# EAGLE schematic FubarinoMini_v17 (EAGLE 9.0.1)
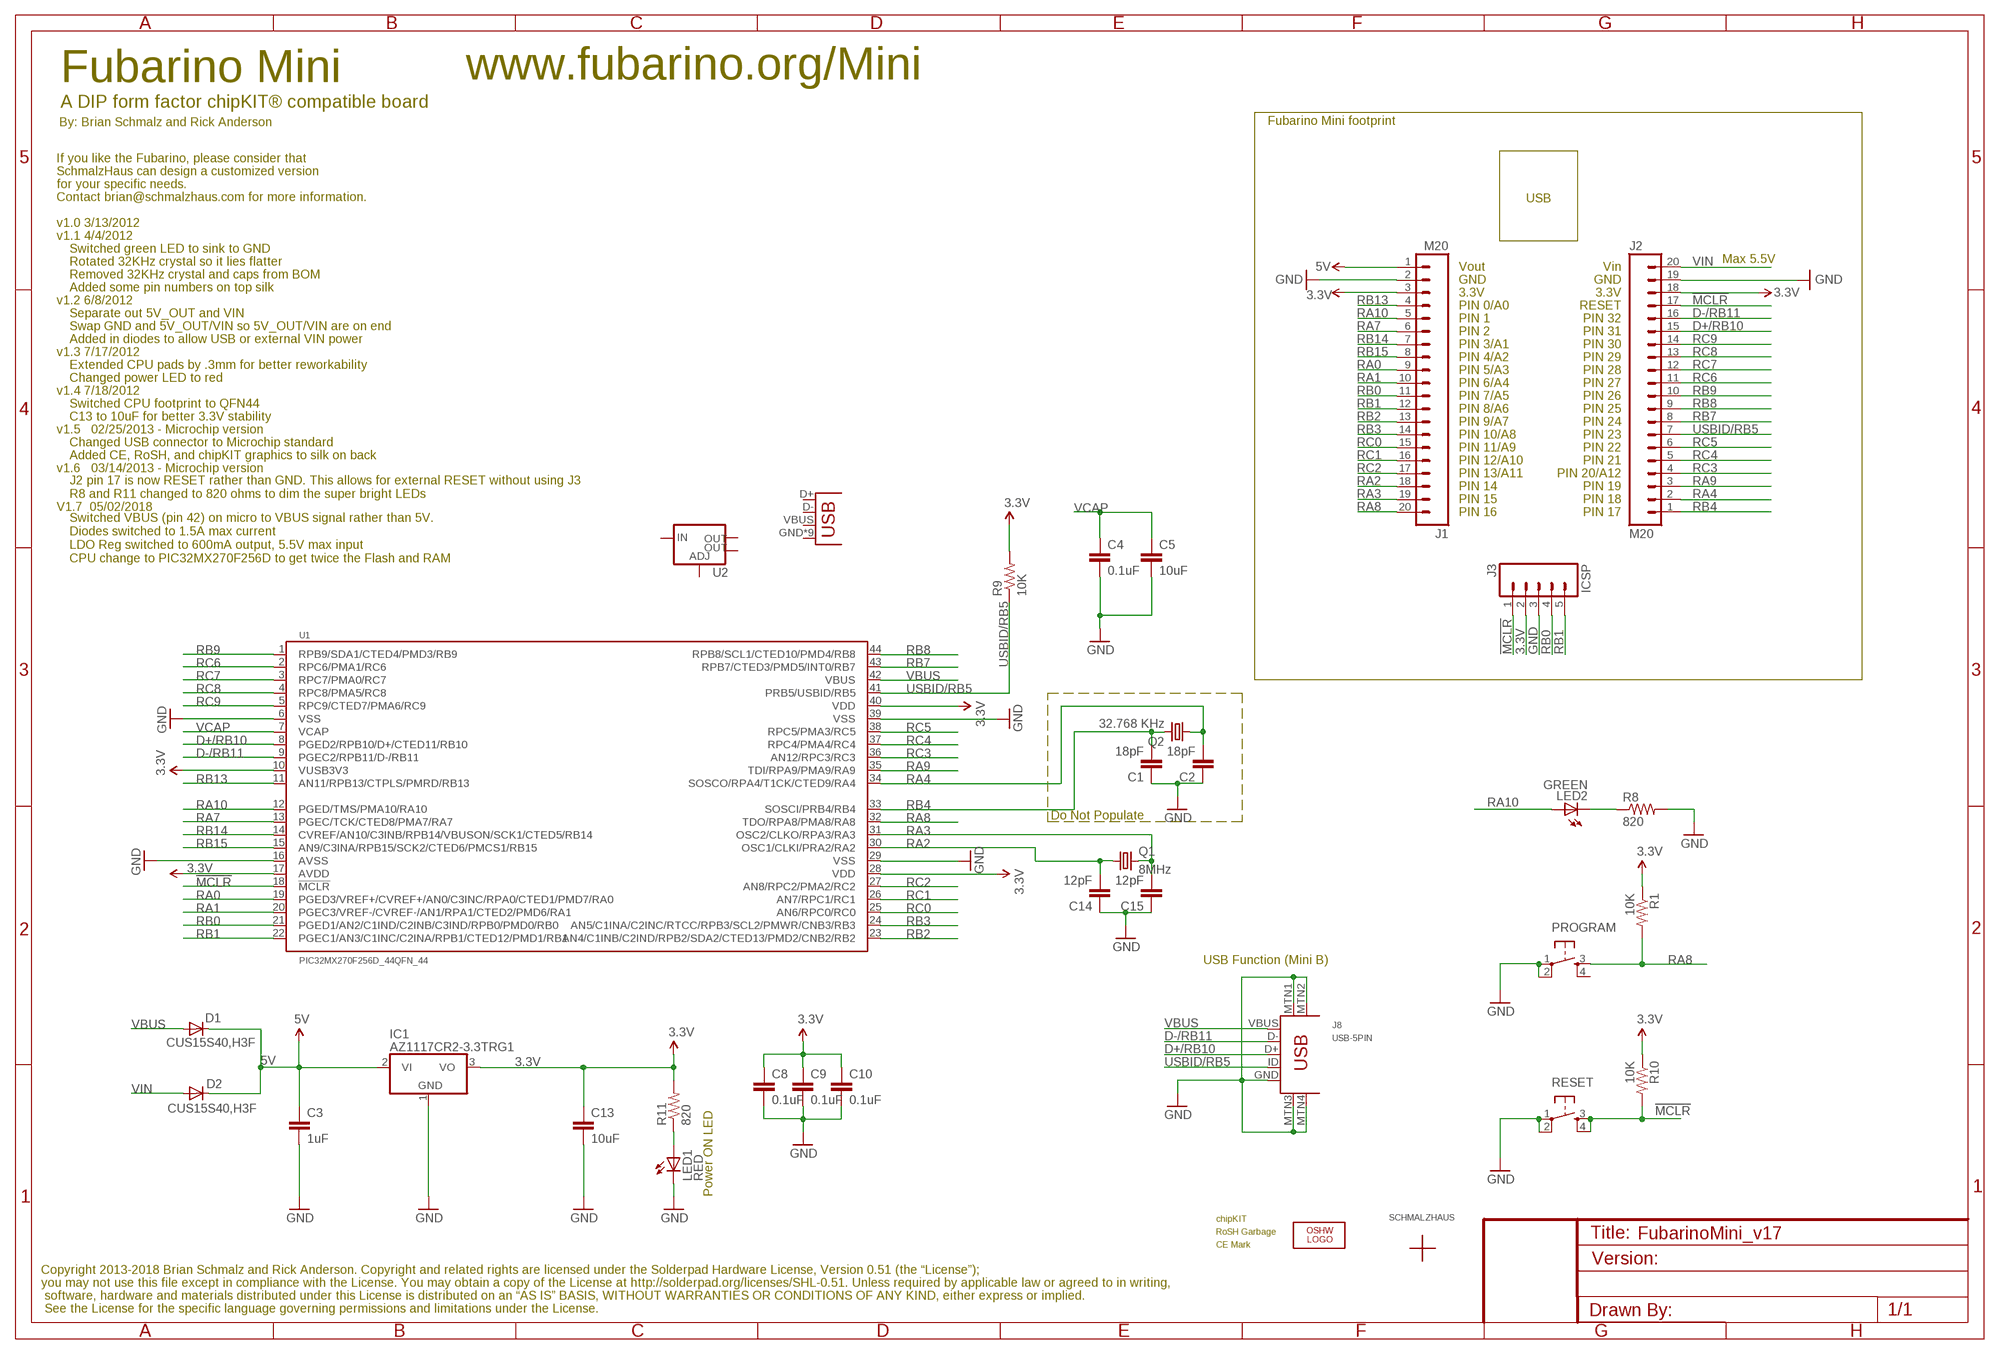
[diagram p0: schematic, sheet 1]

## Parts
C1  18pF  CAP0603-CAP  [0603-CAP]
C2  18pF  CAP0603-CAP  [0603-CAP]
C3  1uF  CAP0603-CAP  [0603-CAP]
C4  0.1uF  CAP0603-CAP  [0603-CAP]
C5  10uF  CAP0805  [0805]
C8  0.1uF  CAP0603-CAP  [0603-CAP]
C9  0.1uF  CAP0603-CAP  [0603-CAP]
C10  0.1uF  CAP0603  [0603]
C13  10uF  CAP0805  [0805]
C14  12pF  CAP0603-CAP  [0603-CAP]
C15  12pF  CAP0603-CAP  [0603-CAP]
D1  CUS15S40,H3F  DIODESOD  [SOD-323]
D2  CUS15S40,H3F  DIODESOD  [SOD-323]
IC1  AZ1117CR2-3.3TRG1  MCP170333MB  [SOT89]
ICSP  J3  M05NOSLILK  [1X05_NOSILK]
J1  M20  [1X20_NO_PIN1]
J2  M20  [1X20_NO_PIN1]
J8  USB-5PIN  [USB-MINIB-5PIN-HIROSE-UX60-MB-5ST]
LED1  RED  LED0603  [LED-0603]
LED2  GREEN  LED0603  [LED-0603]
LOGO1  OSHW_LOGO_8MILX0070-NT  [OSHW_8X70_NOTEXT]
PROGRAM  TAC_SWITCHSND  [TACTILE_SWITCH_SMD]
Q1  8MHz  CRYSTALNX5032  [NX5032_5MM_3.2MM_CRYSTAL]
Q2  32.768 KHz  CRYSTALTC26H  [TC26H]
R1  10K  RESISTOR0603-RES  [0603-RES]
R8  820  RESISTOR0603-RES  [0603-RES]
R9  10K  RESISTOR0603-RES  [0603-RES]
R10  10K  RESISTOR0603-RES  [0603-RES]
R11  820  RESISTOR0603-RES  [0603-RES]
RESET  TAC_SWITCHSND  [TACTILE_SWITCH_SMD]
U1  PIC32MX270F256D_44QFN_44  PIC32MX2XX_44QFN44  [QFN-44-8X8-NOPAD]
U2  V_REG_LM1117SOT223  [SOT223]
U$1  SCHMALZHAUSSCHMALZHAUS_SMALL  [SCHMALZHAUS_SMALL]
U$2  CE_MARK5MM  [CE_5MM]
U$3  ROSH_GARBAGE  [ROHS_GARBAGE_5MM]
U$4  CHIPKIT2MM  [CHIPKIT_2MM]
U$5  USBMICROB  [USB-MICROB_FCI_PINS]

## Nets
3.3V: C8.1 C9.1 C10.1 C13.1 IC1.3(VO) ICSP.2 J1.3 J2.18 R1.1 R9.2 R10.1 R11.2 U1.10(VUSB3V3) U1.17(AVDD) U1.28(VDD) U1.40(VDD)
5V: C3.1 D1.1(C) D2.1(C) IC1.2(VI) IC1.2@1(VI1) J1.1
!MCLR!: ICSP.1 J2.17 R10.2 RESET.3 RESET.4 U1.18(!MCLR!)
D+/RB10: J2.15 J8.D+ U1.8(PGED2/RPB10/D+/CTED11/RB10)
D-/RB11: J2.16 J8.D- U1.9(PGEC2/RPB11/D-/RB11)
GND: C1.1 C2.1 C3.2 C4.2 C5.2 C8.2 C9.2 C10.2 C13.2 C14.1 C15.1 IC1.1(GND) ICSP.3 J1.2 J2.19 J8.GND J8.MTN1 J8.MTN2 J8.MTN3 J8.MTN4 LED1.C PROGRAM.1 PROGRAM.2 R8.2 RESET.1 RESET.2 U1.6(VSS) U1.16(AVSS) U1.29(VSS) U1.39(VSS)
N$6: LED1.A R11.1
N$20: LED2.C R8.1
RA0: J1.9 U1.19(PGED3/VREF+/CVREF+/AN0/C3INC/RPA0/CTED1/PMD7/RA0)
RA1: J1.10 U1.20(PGEC3/VREF-/CVREF-/AN1/RPA1/CTED2/PMD6/RA1)
RA2: C14.2 J1.18 Q1.1 U1.30(OSC1/CLKI/PRA2/RA2)
RA3: C15.2 J1.19 Q1.2 U1.31(OSC2/CLKO/RPA3/RA3)
RA4: C2.2 J2.2 Q2.1 U1.34(SOSCO/RPA4/T1CK/CTED9/RA4)
RA7: J1.6 U1.13(PGEC/TCK/CTED8/PMA7/RA7)
RA8: J1.20 PROGRAM.3 R1.2 U1.32(TDO/RPA8/PMA8/RA8)
RA9: J2.3 U1.35(TDI/RPA9/PMA9/RA9)
RA10: J1.5 LED2.A U1.12(PGED/TMS/PMA10/RA10)
RB0: ICSP.4 J1.11 U1.21(PGED1/AN2/C1IND/C2INB/C3IND/RPB0/PMD0/RB0)
RB1: ICSP.5 J1.12 U1.22(PGEC1/AN3/C1INC/C2INA/RPB1/CTED12/PMD1/RB1)
RB2: J1.13 U1.23(AN4/C1INB/C2IND/RPB2/SDA2/CTED13/PMD2/CNB2/RB2)
RB3: J1.14 U1.24(AN5/C1INA/C2INC/RTCC/RPB3/SCL2/PMWR/CNB3/RB3)
RB4: C1.2 J2.1 Q2.2 U1.33(SOSCI/PRB4/RB4)
RB7: J2.8 U1.43(RPB7/CTED3/PMD5/INT0/RB7)
RB8: J2.9 U1.44(RPB8/SCL1/CTED10/PMD4/RB8)
RB9: J2.10 U1.1(RPB9/SDA1/CTED4/PMD3/RB9)
RB13: J1.4 U1.11(AN11/RPB13/CTPLS/PMRD/RB13)
RB14: J1.7 U1.14(CVREF/AN10/C3INB/RPB14/VBUSON/SCK1/CTED5/RB14)
RB15: J1.8 U1.15(AN9/C3INA/RPB15/SCK2/CTED6/PMCS1/RB15)
RC0: J1.15 U1.25(AN6/RPC0/RC0)
RC1: J1.16 U1.26(AN7/RPC1/RC1)
RC2: J1.17 U1.27(AN8/RPC2/PMA2/RC2)
RC3: J2.4 U1.36(AN12/RPC3/RC3)
RC4: J2.5 U1.37(RPC4/PMA4/RC4)
RC5: J2.6 U1.38(RPC5/PMA3/RC5)
RC6: J2.11 U1.2(RPC6/PMA1/RC6)
RC7: J2.12 U1.3(RPC7/PMA0/RC7)
RC8: J2.13 U1.4(RPC8/PMA5/RC8)
RC9: J2.14 U1.5(RPC9/CTED7/PMA6/RC9)
USBID/RB5: J2.7 J8.ID R9.1 U1.41(PRB5/USBID/RB5)
VBUS: D1.2(A) J8.VBUS U1.42(VBUS)
VCAP: C4.1 C5.1 U1.7(VCAP)
VIN: D2.2(A) J2.20
Unconnected: PROGRAM.4 U2.1(ADJ) U2.2(OUT) U2.3(IN) U2.4(OUT) U$5.D+ U$5.D- U$5.GND U$5.GND@1(GND) U$5.GND@2(GND) U$5.GND@3(GND) U$5.GND@4(GND) U$5.GND@5(GND) U$5.GND@6(GND) U$5.GND@7(GND) U$5.GND@8(GND) U$5.VBUS

## Notes on the sheet
- Fubarino Mini | www.fubarino.org/Mini
- A DIP form factor chipKIT® compatible board
- By: Brian Schmalz and Rick Anderson | Fubarino Mini footprint
- If you like the Fubarino, please consider that
- SchmalzHaus can design a customized version
- for your specific needs.
- Contact brian@schmalzhaus.com for more information. | USB
- v1.0 3/13/2012
- v1.1 4/4/2012
- Switched green LED to sink to GND
- Vin | Max 5.5V
- Rotated 32KHz crystal so it lies flatter
- Vout
- GND
- Removed 32KHz crystal and caps from BOM
- GND
- 3.3V
- Added some pin numbers on top silk
- 3.3V
- RESET
- v1.2 6/8/2012
- PIN 0/A0
- PIN 32
- Separate out 5V_OUT and VIN
- PIN 1
- PIN 31
- Swap GND and 5V_OUT/VIN so 5V_OUT/VIN are on end
- PIN 2
- PIN 30
- Added in diodes to allow USB or external VIN power
- PIN 3/A1
- PIN 29
- v1.3 7/17/2012
- PIN 4/A2
- PIN 28
- Extended CPU pads by .3mm for better reworkability
- PIN 5/A3
- PIN 27
- Changed power LED to red
- PIN 6/A4
- PIN 26
- v1.4 7/18/2012
- PIN 7/A5
- PIN 25
- Switched CPU footprint to QFN44
- PIN 8/A6
- PIN 24
- C13 to 10uF for better 3.3V stability
- PIN 9/A7
- PIN 23
- v1.5   02/25/2013 - Microchip version
- PIN 10/A8
- PIN 22
- Changed USB connector to Microchip standard
- PIN 11/A9
- PIN 21
- Added CE, RoSH, and chipKIT graphics to silk on back
- PIN 12/A10
- PIN 20/A12
- v1.6   03/14/2013 - Microchip version
- PIN 13/A11
- PIN 19
- PIN 14
- PIN 18
- J2 pin 17 is now RESET rather than GND. This allows for external RESET without using J3
  R8 and R11 changed to 820 ohms to dim the super bright LEDs
- PIN 15
- PIN 17
- V1.7  05/02/2018
- PIN 16
- Switched VBUS (pin 42) on micro to VBUS signal rather than 5V.
  Diodes switched to 1.5A max current
  LDO Reg switched to 600mA output, 5.5V max input
  CPU change to PIC32MX270F256D to get twice the Flash and RAM
- Do Not Populate
- USB Function (Mini B)
- Power ON LED
- Copyright 2013-2018 Brian Schmalz and Rick Anderson. Copyright and related rights are licensed under the Solderpad Hardware License, Version 0.51 (the “License”);
- you may not use this file except in compliance with the License. You may obtain a copy of the License at http://solderpad.org/licenses/SHL-0.51. Unless required by applicable law or agreed to in writing,
- software, hardware and materials distributed under this License is distributed on an “AS IS” BASIS, WITHOUT WARRANTIES OR CONDITIONS OF ANY KIND, either express or implied.
- See the License for the specific language governing permissions and limitations under the License.

## Library data of the parts
C1-C4 C8 C9 C14 C15 = SparkFun:CAP: Capacitor Standard 0603 ceramic capacitor, and 0.1" leaded capacitor.
C5 = SchmalzHaus:CAP: Capacitor Standard 0603 ceramic capacitor, and 0.1" leaded capacitor.
C10 C13 = SparkFun02-20-08:CAP: Capacitor Standard 0603 ceramic capacitor, and 0.1" leaded capacitor.
D1 D2 = SparkFun:DIODE: Diode These are standard reverse protection diodes and small signal diodes. SMA package can handle up to about 1A. SOD-323 can handle about 200mA. What the SOD-323 package when ordering, there are some mfgs out there that are 5-pin packages.
IC1 = linear:MCP1703*: 250 mA, 16V, Low Quiescent Current LDO Regulator Source: http://ww1.microchip.com/downloads/en/DeviceDoc/22049b.pdf
ICSP = SchmalzHaus:M05: Header 5 Standard 5-pin 0.1" header. Use with straight break away headers (SKU : PRT-00116), right angle break away headers (PRT-00553), swiss pins (PRT-00743), machine pins (PRT-00117), and female headers (PRT-00115). Molex polarized connector foot print use with SKU : PRT-08230 with associated crimp pins and housings.
J1 J2 = SchmalzHaus:M20
J8 = SchmalzHaus:USB-5PIN
LED1 LED2 = SparkFun:LED: LEDs Standard schematic elements and footprints for 5mm, 3mm, 1206, and 0603 sized LEDs. 5mm - Spark Fun Electronics SKU : COM-00529 (and others)
LOGO1 = OSHW:OSHW_LOGO_8MIL
PROGRAM RESET = SparkFun02-20-08:TAC_SWITCH: Momentary Switch Button commonly used for reset or general input. Spark Fun Electronics SKU : COM-00097
Q1 Q2 = SchmalzHaus:CRYSTAL: Crystals Various standard crystals. Proven footprints. Spark Fun Electronics SKU : COM-00534
R1 R8-R11 = SparkFun:RESISTOR: Resistor Basic schematic elements and footprints for 0603, 1206, and PTH resistors.
U1 = SchmalzHaus:PIC32MX2XX_44
U2 = SparkFun-IC-Power:V_REG_LM1117: Voltage Regulator LM1117 Standard adjustable voltage regulator but in SMD form. Spark Fun Electronics SKU : COM-00595; PROD_ID: VREG-08170
U$1 = SchmalzHaus:SCHMALZHAUS
U$2 = SchmalzHausPublic:CE_MARK
U$3 = SchmalzHausPublic:ROSH_GARBAGE
U$4 = SchmalzHausPublic:CHIPKIT
U$5 = SchmalzHaus:USB: USB Connectors USB-B-PTH is fully proven SKU : PRT-00139 USB-miniB is fully proven SKU : PRT-00587 USB-A-PCB is untested. USB-A-H is throughly reviewed, but untested. Spark Fun Electronics SKU : PRT-00437 USB-B-SMT is throughly reviewed, but untested. Needs silkscreen touching up. USB-A-S has not been used/tested USB-MB-H has not been used/tested